# EAGLE design board_autorouted_2_layers-v2 (EAGLE 6.6.0)
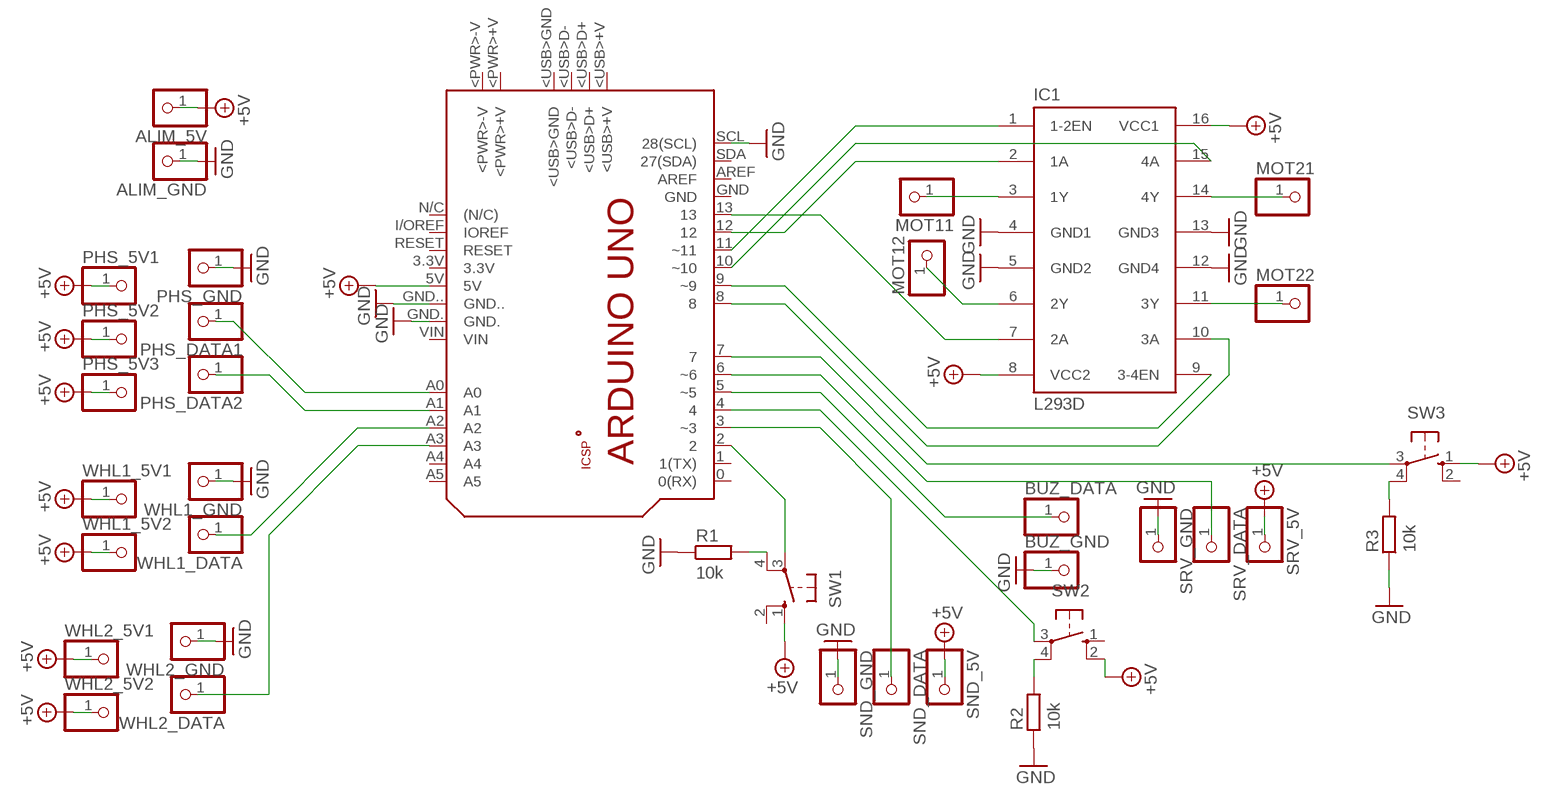
[diagram p0: schematic, sheet 1]

## Parts
ALIM_5V  PINHD-1X1  [1X01]
ALIM_GND  PINHD-1X1  [1X01]
BUZ_DATA  PINHD-1X1  [1X01]
BUZ_GND  PINHD-1X1  [1X01]
IC1  L293D  [DIL16]
MOT11  PINHD-1X1  [1X01]
MOT12  PINHD-1X1  [1X01]
MOT21  PINHD-1X1  [1X01]
MOT22  PINHD-1X1  [1X01]
PCB1  ARDUINO_UNO  [ARDUINO_UNO]
PHS_5V1  PINHD-1X1  [1X01]
PHS_5V2  PINHD-1X1  [1X01]
PHS_5V3  PINHD-1X1  [1X01]
PHS_DATA1  PINHD-1X1  [1X01]
PHS_DATA2  PINHD-1X1  [1X01]
PHS_GND  PINHD-1X1  [1X01]
R1  10k  RESISTOR  [R0603]
R2  10k  RESISTOR  [R0603]
R3  10k  RESISTOR  [R0603]
SND_5V  PINHD-1X1  [1X01]
SND_DATA  PINHD-1X1  [1X01]
SND_GND  PINHD-1X1  [1X01]
SRV_5V  PINHD-1X1  [1X01]
SRV_DATA  PINHD-1X1  [1X01]
SRV_GND  PINHD-1X1  [1X01]
SW1  40-XX  [B3F-40XX]
SW2  40-XX  [B3F-40XX]
SW3  40-XX  [B3F-40XX]
WHL1_5V1  PINHD-1X1  [1X01]
WHL1_5V2  PINHD-1X1  [1X01]
WHL1_DATA  PINHD-1X1  [1X01]
WHL1_GND  PINHD-1X1  [1X01]
WHL2_5V1  PINHD-1X1  [1X01]
WHL2_5V2  PINHD-1X1  [1X01]
WHL2_DATA  PINHD-1X1  [1X01]
WHL2_GND  PINHD-1X1  [1X01]

## Nets
+5V: ALIM_5V.1 IC1.8(VCC2) IC1.16(VCC1) PCB1.5V PHS_5V1.1 PHS_5V2.1 PHS_5V3.1 SND_5V.1 SRV_5V.1 SW1.1(S) SW2.2(S1) SW3.1(S) WHL1_5V1.1 WHL1_5V2.1 WHL2_5V1.1 WHL2_5V2.1
GND: ALIM_GND.1 BUZ_GND.1 IC1.4(GND1) IC1.5(GND2) IC1.12(GND4) IC1.13(GND3) PCB1.GND. PCB1.GND.. PCB1.SCL(28(SCL)) PHS_GND.1 R1.1 R2.1 R3.1 SND_GND.1 SRV_GND.1 WHL1_GND.1 WHL2_GND.1
N$1: IC1.3(1Y) MOT11.1
N$2: IC1.6(2Y) MOT12.1
N$3: IC1.14(4Y) MOT21.1
N$4: IC1.11(3Y) MOT22.1
N$5: IC1.2(1A) PCB1.12
N$6: IC1.7(2A) PCB1.13
N$7: IC1.15(4A) PCB1.10(~10)
N$8: IC1.9(3-4EN) PCB1.9(~9)
N$9: IC1.10(3A) PCB1.8
N$10: IC1.1(1-2EN) PCB1.11(~11)
N$11: PCB1.A1 PHS_DATA2.1
N$12: PCB1.A0 PHS_DATA1.1
N$13: PCB1.A3 WHL2_DATA.1
N$14: PCB1.6(~6) SRV_DATA.1
N$15: PCB1.3(~3) SND_DATA.1
N$16: BUZ_DATA.1 PCB1.5(~5)
N$17: PCB1.7 SW3.3(P)
N$18: R3.2 SW3.4(P1)
N$19: PCB1.4 SW2.3(P)
N$20: R2.2 SW2.4(P1)
N$21: R1.2 SW1.4(P1)
N$22: PCB1.A2 WHL1_DATA.1
N$24: PCB1.2 SW1.3(P)
Unconnected: PCB1.0(0(RX)) PCB1.1(1(TX)) PCB1.3.3V PCB1.+5V PCB1.<PWR>+V PCB1.<PWR>-V PCB1.<USB>+V PCB1.<USB>D+ PCB1.<USB>D- PCB1.<USB>GND PCB1.A4 PCB1.A5 PCB1.AREF PCB1.GND PCB1.GND_ PCB1.I/OREF(IOREF) PCB1.MISO PCB1.MOSI PCB1.N/C((N/C)) PCB1.RESET PCB1.RESET. PCB1.SCK PCB1.SDA(27(SDA)) PCB1.VIN SW1.2(S1) SW2.1(S) SW3.2(S1)

## Library data of the parts
ALIM_5V ALIM_GND BUZ_DATA BUZ_GND MOT11 MOT12 MOT21 MOT22 PHS_5V1-PHS_5V3 PHS_DATA1 PHS_DATA2 PHS_GND SND_5V SND_DATA SND_GND SRV_5V SRV_DATA SRV_GND WHL1_5V1 WHL1_5V2 WHL1_DATA WHL1_GND WHL2_5V1 WHL2_5V2 WHL2_DATA WHL2_GND = pinhead:PINHD-1X1: PIN HEADER
IC1 = st-microelectronics:L293D: PUSH-PULL 4 CHANNEL DRIVER; MPN: L293D; OC_FARNELL: 9589619; OC_NEWARK: 56P8249
PCB1 = E14_Arduino_revB:ARDUINO_UNO: Device for representing an Arduino Uno board with a footprint in an EAGLE design. Created by Dave Young for Element14. More EAGLE documentation at: http://www.element14.com/community/community/knode/cadsoft_eagle
R1-R3 = BaseApp:RESISTOR: Resistance Package :- 0603 Mount :-Surface mount
SW1-SW3 = adafruit:40-XX: OMRON SWITCH; MF: OMRON COMPONENTS USA; MPN: B3F-4000; OC_FARNELL: 176434; OC_NEWARK: 36K3105

## Board
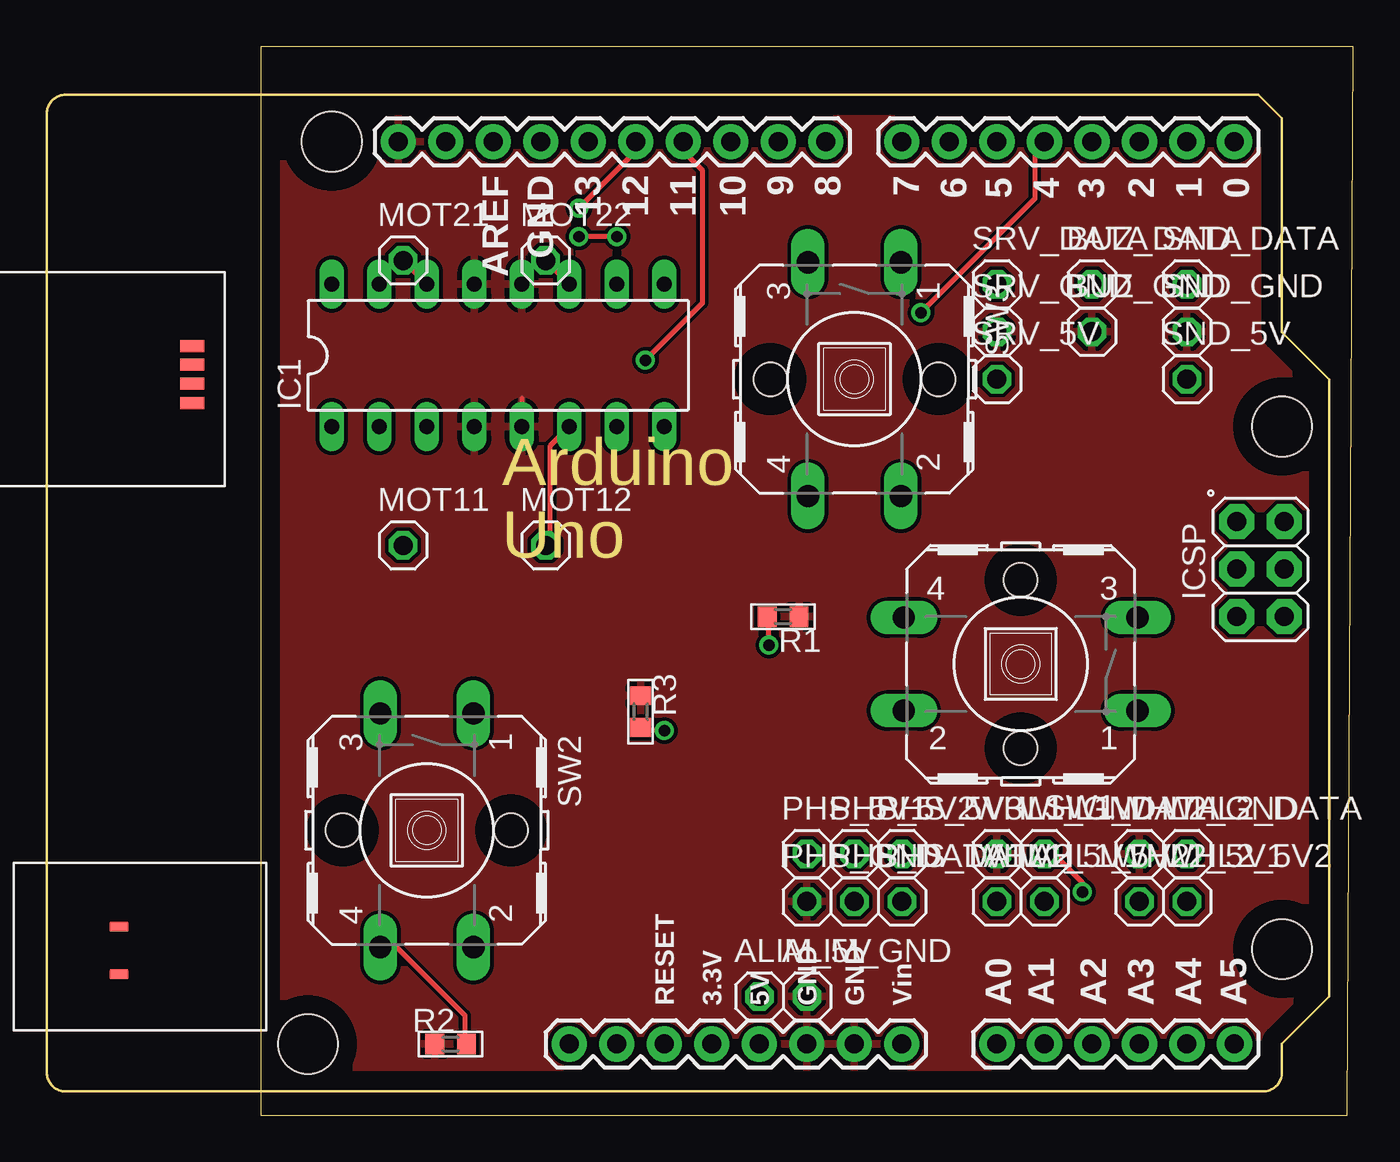
[diagram p1: board, top side]
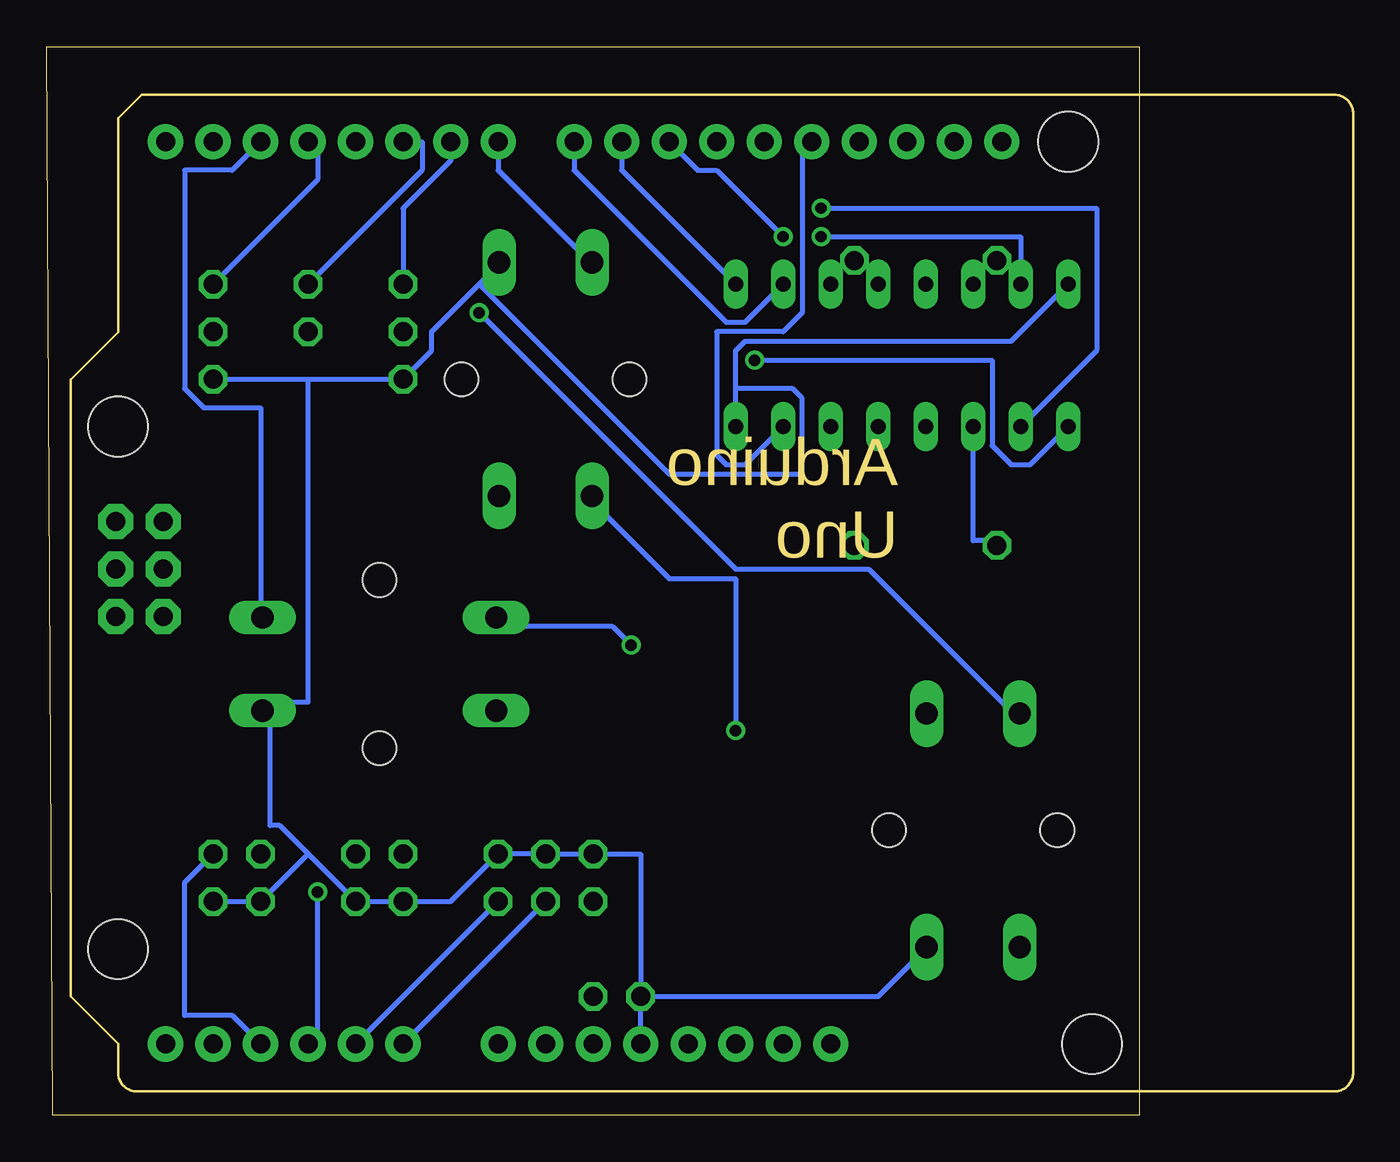
[diagram p2: board, bottom side, seen from below]

Size 58.42 x 57.15 mm. Coordinates in mm from the lower left corner, seen from the top.
Outline: 0,0 58.09,0 58.42,57.15 0,57.14 0,0
Copper layers (1*16): Top 0.035mm / dielectric 1.5mm / Bottom 0.035mm
Design rules "default": minimum track width 10mil, minimum drill 24mil, track to track 8mil, track to pad 8mil, pad to pad 8mil, via to via 8mil, smd to smd 8mil, copper to edge 40mil, drill to drill 8mil, minimum pad ring 10mil, minimum via ring 8mil, stop-mask expansion 4mil, vias tented up to drill 0mil, thermal gap 10mil

### Footprints (pad centres in the part's own frame; a part is rotated, then mirrored left to right if it is on the bottom)
1X01 = drill 1.016 octagon: 1 0,0
DIL16 = drill 0.813 long: 1 -8.89,-3.81; 2 -6.35,-3.81; 3 -3.81,-3.81; 4 -1.27,-3.81; 5 1.27,-3.81; 6 3.81,-3.81; 7 6.35,-3.81; 8 8.89,-3.81; 9 8.89,3.81; 10 6.35,3.81; 11 3.81,3.81; 12 1.27,3.81; 13 -1.27,3.81; 14 -3.81,3.81; 15 -6.35,3.81; 16 -8.89,3.81
ARDUINO_UNO = drill 1.016 pad 1.88: 0 63.5,50.8; 1 60.96,50.8; 2 58.42,50.8; 3 55.88,50.8; 3.3V 35.56,2.54; 4 53.34,50.8; 5 50.8,50.8; 5V 38.1,2.54; 6 48.26,50.8; 7 45.72,50.8; 8 41.656,50.8; 9 39.116,50.8; 10 36.576,50.8; 11 34.036,50.8; 12 31.496,50.8; 13 28.956,50.8; A0 50.8,2.54; A1 53.34,2.54; A2 55.88,2.54; A3 58.42,2.54; A4 60.96,2.54; A5 63.5,2.54; AREF 23.876,50.8; GND 26.416,50.8; GND. 43.18,2.54; GND.. 40.64,2.54; I/OREF 30.48,2.54; N/C 27.94,2.54; RESET 33.02,2.54; SCL 18.796,50.8; SDA 21.336,50.8; VIN 45.72,2.54 | drill 1.016 pad 1.88 octagon: +5V 66.167,30.48; GND_ 66.167,25.4; MISO 63.627,30.48; MOSI 66.167,27.94; RESET. 63.627,25.4; SCK 63.627,27.94 | smd 1.016 x 0.508: <PWR>+V 3.861,8.814; <PWR>-V 3.861,6.274 | smd 1.27 x 0.635: <USB>+V 7.772,39.878; <USB>D+ 7.772,38.887; <USB>D- 7.772,37.871; <USB>GND 7.772,36.83 | hole 3.2: 66.04,7.62; 66.04,35.56; 15.24,50.8; 13.97,2.54
R0603 = smd 1 x 1.1: 1 -0.85,0; 2 0.85,0
B3F-40XX = drill 1.194 long: 1 -6.248,2.489; 2 6.248,2.489; 3 -6.248,-2.489; 4 6.248,-2.489 | hole 1.803: 0,-4.496; 0,4.496

### Placement (x,y rotation side)
ALIM_5V  26.67,6.35 0 top
ALIM_GND  29.21,6.35 0 top
BUZ_DATA  44.45,44.45 0 top
BUZ_GND  44.45,41.91 0 top
IC1  12.7,40.64 0 top
MOT11  7.62,30.48 0 top
MOT12  15.24,30.48 0 top
MOT21  7.62,45.72 0 top
MOT22  15.24,45.72 0 top
PCB1  -11.43,1.27 0 top
PHS_5V1  29.21,13.97 0 top
PHS_5V2  31.75,13.97 0 top
PHS_5V3  34.29,13.97 0 top
PHS_DATA1  31.75,11.43 0 top
PHS_DATA2  34.29,11.43 0 top
PHS_GND  29.21,11.43 0 top
R1  27.94,26.67 180 top
R2  10.16,3.81 0 top
R3  20.32,21.59 270 top
SND_5V  49.53,39.37 0 top
SND_DATA  49.53,44.45 0 top
SND_GND  49.53,41.91 0 top
SRV_5V  39.37,39.37 0 top
SRV_DATA  39.37,44.45 0 top
SRV_GND  39.37,41.91 0 top
SW1  40.64,24.13 180 top
SW2  8.89,15.24 270 top
SW3  31.75,39.37 270 top
WHL1_5V1  39.37,11.43 0 top
WHL1_5V2  41.91,11.43 0 top
WHL1_DATA  41.91,13.97 0 top
WHL1_GND  39.37,13.97 0 top
WHL2_5V1  46.99,11.43 0 top
WHL2_5V2  49.53,11.43 0 top
WHL2_DATA  49.53,13.97 0 top
WHL2_GND  46.99,13.97 0 top

### Tracks (layer width: path | path; a pad name or v marks a point on that pad's centre or on a via)
+5V
  Bottom 0.254: IC1.16 6.86,41.4 21.08,41.4 21.59,40.89 21.59,38.86 | IC1.8 21.59,38.86 | SND_5V.1 44.45,39.37 | 44.45,39.37 SRV_5V.1 37.85,40.89 37.85,41.91 35.31,44.45 | 35.31,44.45 34.29,45.47 SW3.1 | PCB1.5V ALIM_5V.1 | ALIM_5V.1 13.97,6.35 11.43,8.89 SW2.2 | WHL2_5V2.1 WHL2_5V1.1 44.45,13.97 | 44.45,13.97 WHL1_5V2.1 WHL1_5V1.1 36.83,11.43 PHS_5V3.1 PHS_5V2.1 PHS_5V1.1 26.67,13.97 ALIM_5V.1 | 44.45,13.97 45.97,15.49 46.48,15.49 46.48,21.59 SW1.1 46.48,22.1 44.45,22.1 44.45,39.37 | 21.59,38.86 18.54,38.86 18.03,38.35 18.03,34.29 25.15,34.29 35.31,44.45
GND
  Top 0.254: 13.97,38.35 IC1.5
  pour Top: -1.27,58.42 -1.27,-1.27 59.69,-1.27 59.69,58.42
N$1
  Bottom 0.254: IC1.3 8.89,30.73 7.87,30.73 MOT11.1
N$2
  Top 0.254: IC1.6 15.49,35.81 15.49,30.73 MOT12.1
N$3
  Top 0.254: MOT21.1 IC1.14
N$4
  Top 0.254: MOT22.1 IC1.11
N$5  (via drill 0.61)
  Top 0.254: v17.02,48.51 20.07,51.56 PCB1.12
  Bottom 0.254: IC1.2 2.29,40.89 2.29,48.51 v17.02,48.51
N$6
  Bottom 0.254: IC1.7 21.08,34.8 22.1,34.8 22.61,35.31 22.61,41.91 19.05,41.91 18.03,42.93 18.03,52.07 PCB1.13
N$7  (via drill 0.61)
  Top 0.254: v19.05,46.99 v17.02,46.99
  Bottom 0.254: IC1.15 6.35,46.99 v17.02,46.99 | v19.05,46.99 22.61,50.55 23.62,50.55 PCB1.10
N$8
  Bottom 0.254: IC1.9 27.69,50.55 PCB1.9
N$9
  Bottom 0.254: IC1.10 21.08,42.42 22.1,42.42 30.23,50.55 PCB1.8
N$10  (via drill 0.61)
  Top 0.254: v20.57,40.39 23.62,43.43 23.62,50.55 22.61,51.56 PCB1.11
  Bottom 0.254: IC1.1 5.84,34.8 6.86,34.8 7.87,35.81 7.87,40.39 v20.57,40.39
N$11
  Bottom 0.254: PCB1.A1 PHS_DATA2.1
N$12
  Bottom 0.254: PCB1.A0 PHS_DATA1.1
N$13
  Bottom 0.254: WHL2_DATA.1 51.05,12.45 51.05,5.33 48.51,5.33 PCB1.A3
N$14
  Bottom 0.254: SRV_DATA.1 39.37,48.51 36.83,51.05 PCB1.6
N$15
  Bottom 0.254: SND_DATA.1 43.94,50.04 43.94,52.07 PCB1.3
N$16
  Bottom 0.254: BUZ_DATA.1 38.35,50.55 38.35,52.07 PCB1.5
N$17
  Bottom 0.254: PCB1.7 34.29,50.55 29.72,45.97 SW3.3
N$18  (via drill 0.61)
  Top 0.254: v21.59,20.57 20.57,20.57 R3.2
  Bottom 0.254: v21.59,20.57 21.59,28.7 25.15,28.7 29.21,32.77 SW3.4
N$19  (via drill 0.61)
  Top 0.254: v35.31,42.93 41.4,49.02 41.4,51.56 PCB1.4
  Bottom 0.254: v35.31,42.93 21.59,29.21 14.48,29.21 6.86,21.59 SW2.3
N$20
  Top 0.254: R2.2 10.92,3.81 10.92,5.33 6.86,9.4 SW2.4
N$21  (via drill 0.61)
  Top 0.254: v27.18,25.15 27.18,26.67 R1.2
  Bottom 0.254: v27.18,25.15 28.19,26.16 34.29,26.16 SW1.4
N$22  (via drill 0.61)
  Top 0.254: WHL1_DATA.1 42.42,13.97 43.94,12.45 v43.94,11.94
  Bottom 0.254: v43.94,11.94 43.94,3.81 PCB1.A2
N$24
  Bottom 0.254: PCB1.2 48.51,50.55 51.05,50.55 51.05,38.86 50.04,37.85 46.99,37.85 46.99,26.67 SW1.3